# Altium project WCAN_Template_Shield.PrjPcb
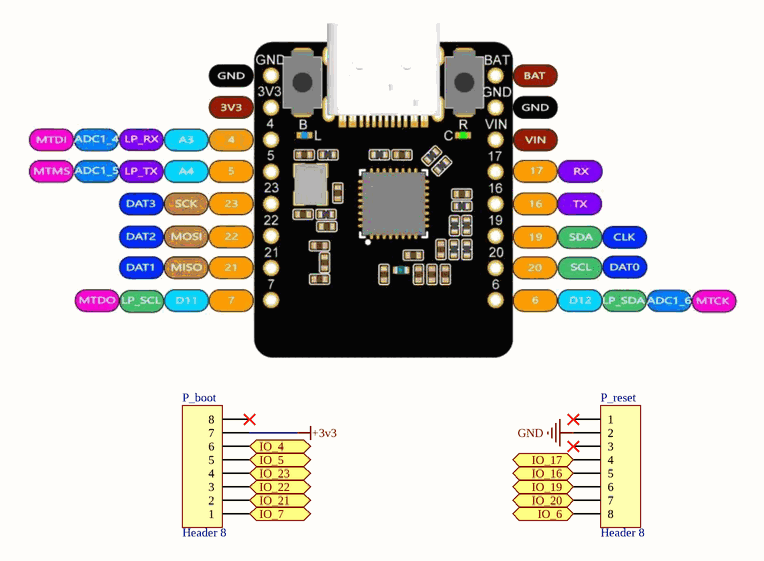
[diagram p0: connectors.SchDoc]
1 sheet, 2 parts. Net scope: flat (ports and power ports of the same name join across sheets).
Board file: shield_template.PcbDoc

## Sheet connectors.SchDoc: Beetle ESP32 C6 Shield Connectors
size A4; Author: Matheus Cirillo; CompanyName: EESC-USP FSAE; DrawnBy: Matheus Cirillo; Engineer: Matheus Cirillo; Organization: University of São Paulo; Revision: 1; SheetNumber: 1; SheetTotal: 1

### Parts
P_boot  Header 8  [HDR1X8]
P_reset  Header 8  [HDR1X8]

### Ports
IO_4 (bidir), IO_5 (bidir), IO_6 (bidir), IO_7 (bidir), IO_16 (bidir), IO_17 (bidir), IO_19 (bidir), IO_20 (bidir), IO_21 (bidir), IO_22 (bidir), IO_23 (bidir)

### Nets
+3v3: P_boot.7
GND: P_reset.2
NetP_boot_1: P_boot.1 ; port IO_7
NetP_boot_2: P_boot.2 ; port IO_21
NetP_boot_3: P_boot.3 ; port IO_22
NetP_boot_4: P_boot.4 ; port IO_23
NetP_boot_5: P_boot.5 ; port IO_5
NetP_boot_6: P_boot.6 ; port IO_4
NetP_reset_4: P_reset.4 ; port IO_17
NetP_reset_5: P_reset.5 ; port IO_16
NetP_reset_6: P_reset.6 ; port IO_19
NetP_reset_7: P_reset.7 ; port IO_20
NetP_reset_8: P_reset.8 ; port IO_6

Not connected (* = marked no-connect by the designer): P_boot 8*; P_reset 1* 3*

### Library data of the parts
P_boot P_reset = Header 8: Header, 8-Pin; LatestRevisionDate: 17-Jul-2002; LatestRevisionNote: Re-released for DXP Platform.; Publisher: Altium Limited